# EAGLE design fietslicht (EAGLE 5.04)
REV: 1; TITLE: BRD100220
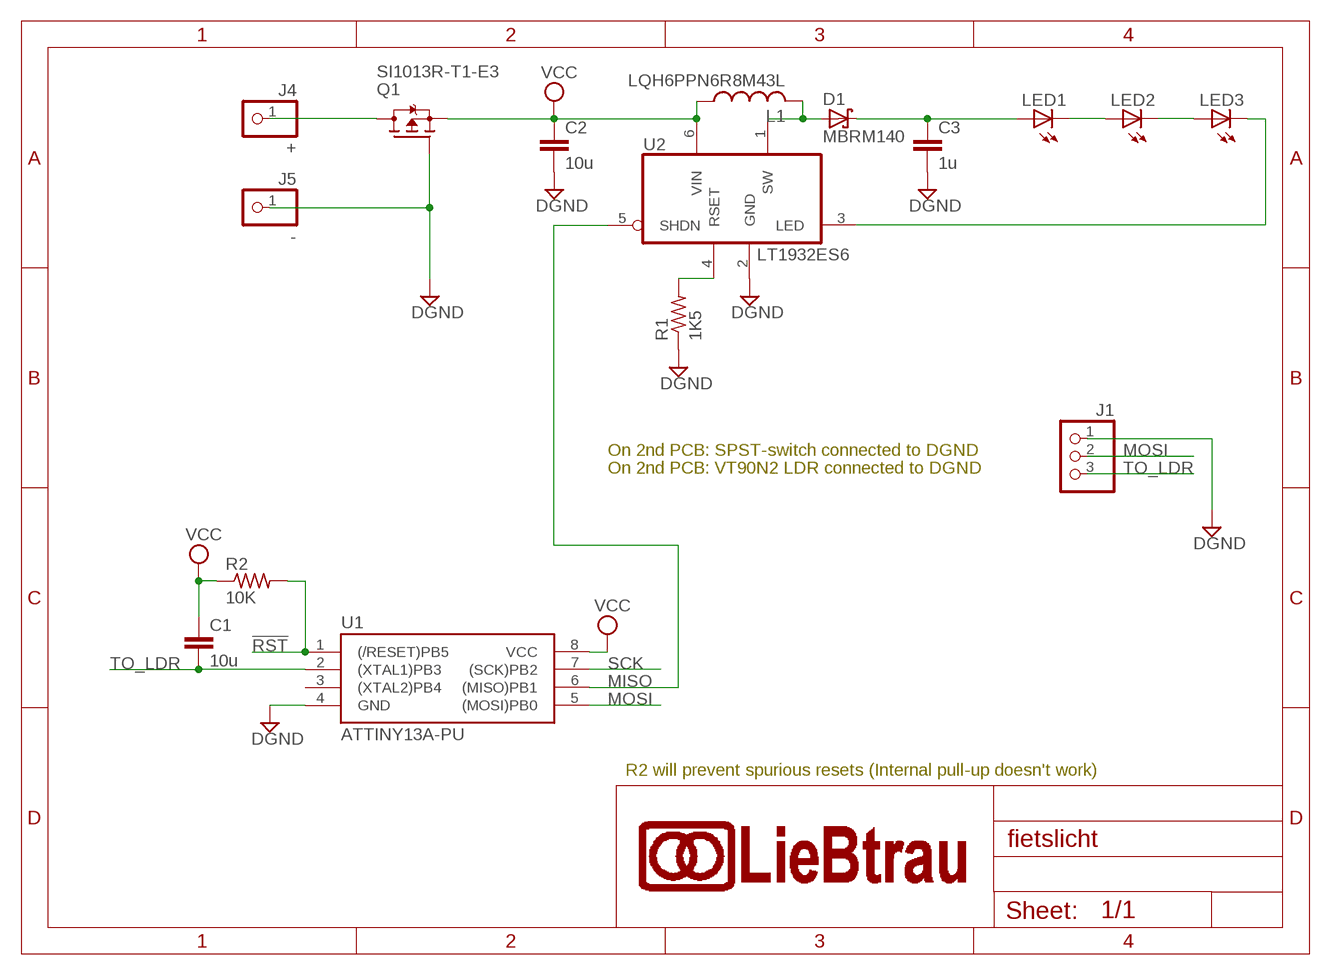
[diagram p0: schematic, sheet 1]

## Parts
C1  10u  C-EUC1206  [C1206]
C2  10u  C-EUC1206  [C1206]
C3  1u  C-EUC1206  [C1206]
D1  MBRM140  [CASE457]
FRAME1  A5L-LOC  [A5L-LOC]
J1  PINHD-1X3  [1X03]
J4  +  PINHD-1X1  [1X01]
J5  -  PINHD-1X1  [1X01]
L1  LQH6PPN6R8M43L  LQH6PP  [L2424]
LED1  LED5MM  [LED5MM]
LED2  LED5MM  [LED5MM]
LED3  LED5MM  [LED5MM]
Q1  SI1013R-T1-E3  [EMT3]
R1  1K5  R-US_R1206  [R1206]
R2  10K  R-US_R1206  [R1206]
U1  ATTINY13A-PU  [DIL08]
U2  LT1932ES6  [SOT23-6]

## Nets
!RST: R2.2 U1.1((/RESET)PB5)
DGND: C2.2 C3.2 J1.1 J5.1 Q1.G R1.1 U1.4(GND) U2.2(GND)
MISO: U1.6((MISO)PB1) U2.5(SHDN)
MOSI: J1.2 U1.5((MOSI)PB0)
N$1: D1.A L1.2 U2.1(SW)
N$3: LED3.K(C) U2.3(LED)
N$4: R1.2 U2.4(RSET)
N$5: LED1.K(C) LED2.A
N$6: C3.1 D1.C LED1.A
N$7: LED2.K(C) LED3.A
N$8: J4.1 Q1.D
SCK: U1.7((SCK)PB2)
TO_LDR: C1.2 J1.3 U1.2((XTAL1)PB3)
VCC: C1.1 C2.1 L1.1 Q1.S R2.1 U1.8(VCC) U2.6(VIN)
Unconnected: U1.3((XTAL2)PB4)

## Notes on the sheet
- On 2nd PCB: SPST-switch connected to DGND
- On 2nd PCB: VT90N2 LDR connected to DGND
- R2 will prevent spurious resets (Internal pull-up doesn't work)

## Library data of the parts
C1-C3 = rcl:C-EU: CAPACITOR, European symbol
D1 = fietslicht:MBRM140
FRAME1 = liebtrau:A5L-LOC: A5L LOC
J1 = pinhead:PINHD-1X3: PIN HEADER
J4 J5 = pinhead:PINHD-1X1: PIN HEADER
L1 = fietslicht:LQH6PP
LED1-LED3 = led:LED: LED OSRAM: - CHIPLED LG R971, LG N971, LY N971, LG Q971, LY Q971, LO R971, LY R971 LH N974, LH R974 LS Q976, LO Q976, LY Q976 LO Q996 - Hyper CHIPLED LW Q18S LB Q993, LB Q99A, LB R99A - SideLED LS A670, LO A670, LY A670, LG A670, LP A670 LB A673, LV A673, LT A673, LW A673 LH A674 LY A675 LS A676, LA A676, LO A676, LY A676, LW A676 LS A679, LY A679, LG A679 - Hyper Micro SIDELED® LS Y876, LA Y876, LO Y876, LY Y876 LT Y87S - SmartLED LW L88C, LW L88S LB L89C, LB L89S, LG L890 LS L89K, LO L89K, LY L89K LS L896, LA L896, LO L896, LY L896 - TOPLED LS T670, LO T670, LY T670, LG T670, LP T670 LSG T670, LSP T670, LSY T670, LOP T670, LYG T670 LG T671, LOG T671, LSG T671 LB T673, LV T673, LT T673, LW T673 LH T674 LS T676, LA T676, LO T676, LY T676, LB T676, LH T676, LSB T676, LW T676 LB T67C, LV T67C, LT T67C, LS T67K, LO T67K, LY T67K, LW E67C LS E67B, LA E67B, LO E67B, LY E67B, LB E67C, LV E67C, LT E67C LW T67C LS T679, LY T679, LG T679 LS T770, LO T770, LY T770, LG T770, LP T770 LB T773, LV T773, LT T773, LW T773 LH T774 LS E675, LA E675, LY E675, LS T675 LS T776, LA T776, LO T776, LY T776, LB T776 LHGB T686 LT T68C, LB T68C - Hyper Mini TOPLED® LB M676 - Mini TOPLED Santana® LG M470 LS M47K, LO M47K, LY M47K Source: http://www.osram.convergy.de LUXEON: - LUMILED® LXK2-PW12-R00, LXK2-PW12-S00, LXK2-PW14-U00, LXK2-PW14-V00 LXK2-PM12-R00, LXK2-PM12-S00, LXK2-PM14-U00 LXK2-PE12-Q00, LXK2-PE12-R00, LXK2-PE12-S00, LXK2-PE14-T00, LXK2-PE14-U00 LXK2-PB12-K00, LXK2-PB12-L00, LXK2-PB12-M00, LXK2-PB14-N00, LXK2-PB14-P00, LXK2-PB14-Q00 LXK2-PR12-L00, LXK2-PR12-M00, LXK2-PR14-Q00, LXK2-PR14-R00 LXK2-PD12-Q00, LXK2-PD12-R00, LXK2-PD12-S00 LXK2-PH12-R00, LXK2-PH12-S00 LXK2-PL12-P00, LXK2-PL12-Q00, LXK2-PL12-R00 Source: www.luxeon.com KINGBRIGHT: KA-3528ASYC Source: www.kingbright.com
Q1 = fietslicht:SI1013R
R1 R2 = rcl:R-US_: RESISTOR, American symbol
U1 = fietslicht:ATTINY13A: MICROCONTROLLER 1 Kbytes FLASH
U2 = fietslicht:LT1932

## Board
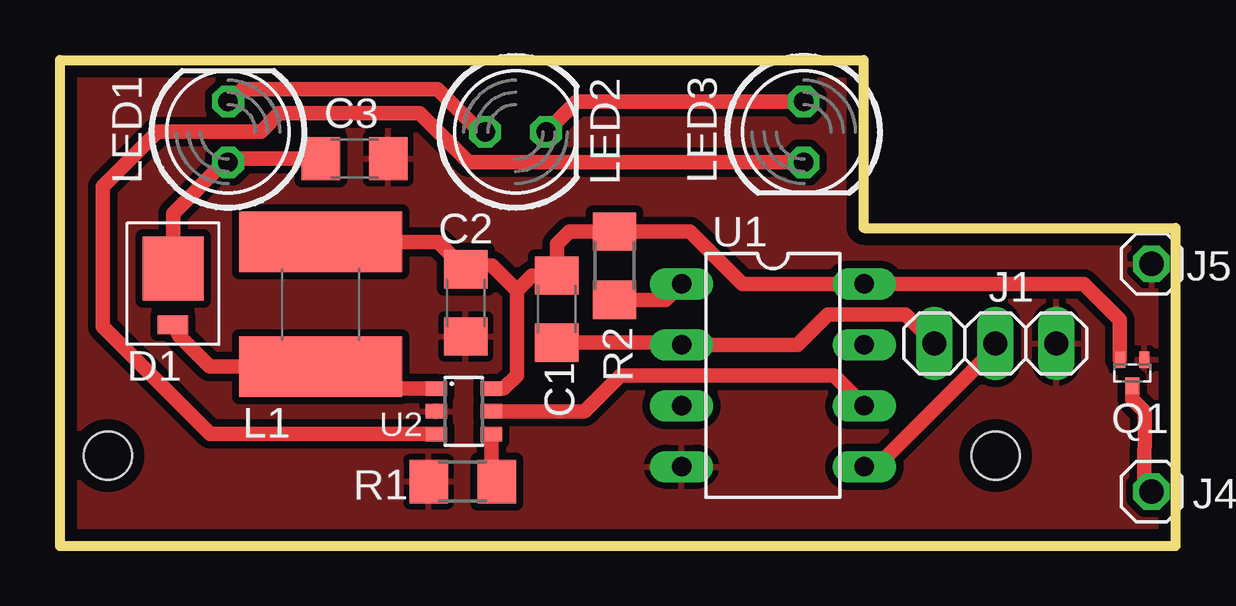
[diagram p1: board, top side]

Size 46.5 x 20.26 mm. Coordinates in mm from the lower left corner, seen from the top.
Outline: 0,0 46.5,0 46.5,13.26 33.5,13.26 33.5,20.26 0,20.26 0,0
Copper layers (1*16): Top 0.035mm / dielectric 1.5mm / Bottom 0.035mm
Design rules "default *": minimum track width 10mil, minimum drill 24mil, track to track 8mil, track to pad 8mil, pad to pad 8mil, via to via 8mil, smd to smd 8mil, copper to edge 20mil, drill to drill 8mil, minimum pad ring 10mil, minimum via ring 8mil, stop-mask expansion 4mil, vias tented up to drill 0mil, thermal gap 10mil
Holes 2 mm at 2,3.76 39,3.76

### Footprints (pad centres in the part's own frame; a part is rotated, then mirrored left to right if it is on the bottom)
C1206 = smd 1.6 x 1.8: 1 -1.4,0; 2 1.4,0
CASE457 = smd 0.762 x 1.27: A 2.35,0 | smd 2.67 x 2.54: C 0,0
1X03 = drill 1.016 long: 1 -2.54,0; 2 0,0; 3 2.54,0
1X01 = drill 1.016 octagon: 1 0,0
L2424 = smd 2.53 x 6.8: 1 -2.6,0; 2 2.6,0
LED5MM = drill 0.813 octagon: A -1.27,0; K 1.27,0
EMT3 = smd 0.6 x 0.7: D 0,0.55 | smd 0.4 x 0.7: G -0.5,-0.55; S 0.5,-0.55
R1206 = smd 1.6 x 1.803: 1 -1.422,0; 2 1.422,0
DIL08 = drill 0.813 long: 1 -3.81,-3.81; 2 -1.27,-3.81; 3 1.27,-3.81; 4 3.81,-3.81; 5 3.81,3.81; 6 1.27,3.81; 7 -1.27,3.81; 8 -3.81,3.81
SOT23-6 = smd 0.6 x 0.9: 1 -0.95,-1.15; 2 0,-1.15; 3 0.95,-1.15; 4 0.95,1.15; 5 0,1.15; 6 -0.95,1.15

### Placement (x,y rotation side)
C1  20.71,9.87 270 top
C2  16.91,10.13 270 top
C3  12.28,16.15 0 top
D1  4.71,11.57 270 top
FRAME1  -65.02,-68.58 0 top  (outside the outline)
J1  38.99,8.44 180 top
J4  45.5,2.26 0 top
J5  45.5,11.76 0 top
L1  10.87,10.07 270 top
LED1  7.01,17.26 90 top
LED2  18.99,17.26 0 top
LED3  31,17.26 270 top
Q1  44.7,7.21 180 top
R1  16.79,2.68 0 top
R2  23.11,11.68 270 top
U1  29.72,7.11 270 top
U2  16.83,5.61 270 top

### Tracks (layer width: path | path; a pad name or v marks a point on that pad's centre or on a via)
!RST
  Top 0.61: R2.2 25.25,10.26 U1.1
DGND
  Top 0.61: J5.1 45.2,11.51
  pour Top (isolate 0.305): -4.57,23.62 -4.57,-4.32 49.28,-4.32 49.28,25.15 45.97,25.15
MISO
  Top 0.61: U2.5 21.86,5.61 23.37,7.11 32.26,7.11 U1.6
MOSI
  Top 0.61: U1.5 34.04,3.3 38.61,7.87 38.86,8.31 J1.2
N$1
  Top 0.61: L1.2 10.97,7.57 | D1.A 4.97,8.75 6.24,7.47 L1.2 | U2.1 11.78,6.56 L1.2
N$3
  Top 0.61: LED3.K 17.03,15.99 14.99,18.03 9.14,18.03 8.38,17.27 4.06,17.27 1.78,14.99 1.78,9.14 6.26,4.66 U2.3
N$4
  Top 0.61: U2.4 17.98,2.92 R1.2
N$5
  Top 0.61: LED1.K 7.1,18.53 7.62,19.05 15.75,19.05 17.54,17.26 LED2.A
N$6
  Top 0.61: D1.C 4.71,13.86 6.85,15.99 LED1.A 7.16,16.15 C3.1
N$7
  Top 0.61: LED3.A 21.53,18.53 LED2.K
N$8
  Top 0.61: Q1.D 44.7,6.1 45.21,5.59 45.21,2.55 J4.1
TO_LDR
  Top 0.61: C1.2 25.82,8.47 U1.2 30.73,8.38 32,9.65 35.24,9.65 J1.3
VCC
  Top 0.406: 44.18,7.76 Q1.S
  Top 0.61: L1.1 15.77,12.67 C2.1 17.07,11.68 18.01,11.68 19.05,10.65 | C1.1 20.83,11.41 | U2.6 18.5,6.56 19.05,7.11 19.05,10.65 | 44.18,7.76 44.18,9.41 42.67,10.92 U1.8 28.45,10.92 26.26,13.11 R2.1 21.23,13.11 20.71,12.58 C1.1 | C1.1 19.68,11.27 19.05,10.65